# EAGLE design pmd_final (EAGLE 9.6.2)
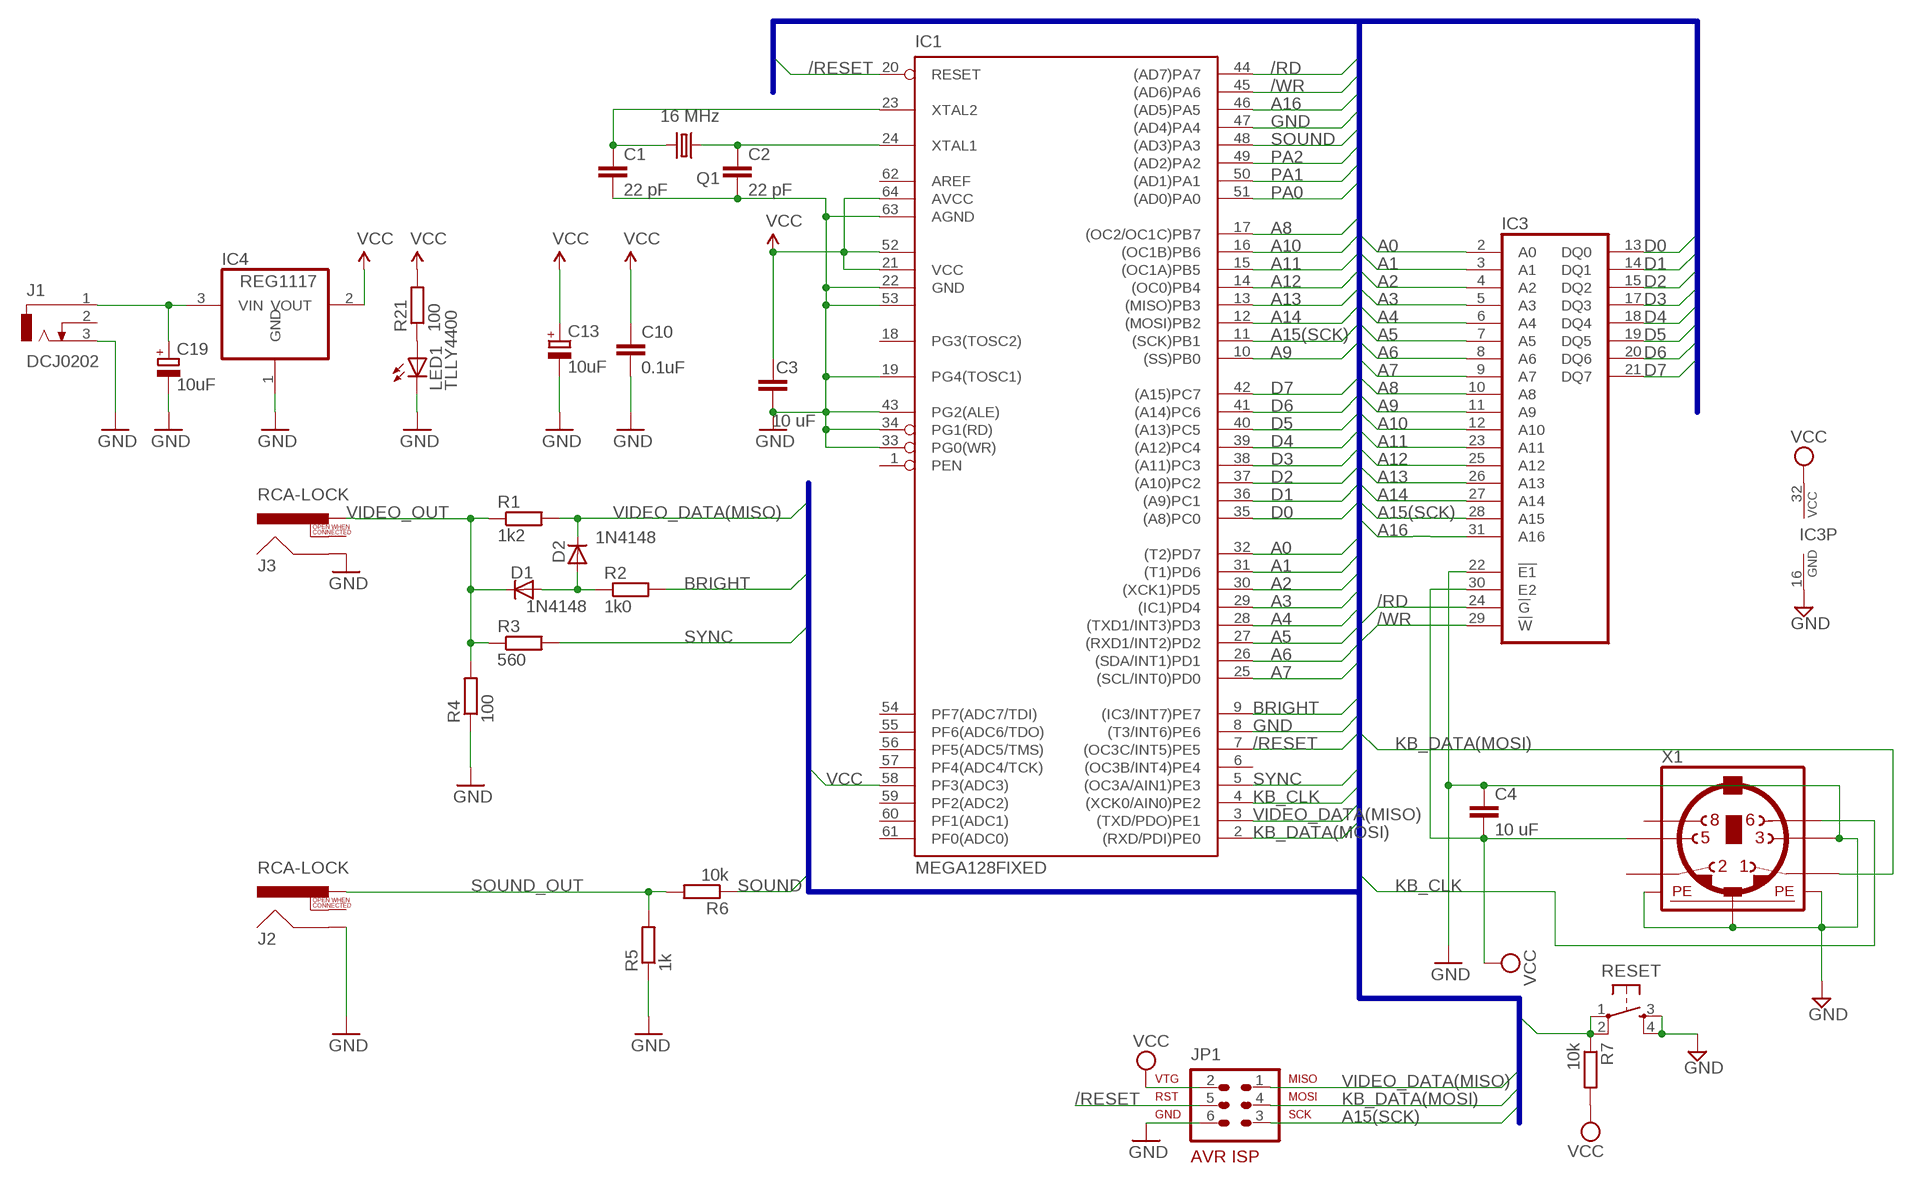
[diagram p0: schematic, sheet 1]

## Parts
C1  22 pF  C-EUC0805  [C0805]
C2  22 pF  C-EUC0805  [C0805]
C3  10 uF  C-EUC0805  [C0805]
C4  10 uF  C-EUC0805  [C0805]
C10  0.1uF  C-EUC0805  [C0805]
C13  10uF  CPOL-EUE2.5-5  [E2,5-5]
C19  10uF  CPOL-EUE2.5-5  [E2,5-5]
D1  1N4148  DIODE-MINIMELF  [MINIMELF]
D2  1N4148  DIODE-MINIMELF  [MINIMELF]
IC1  MEGA128FIXED  [TQFP64_14X14MM]
IC3  MCM6226AULTRAWIDE  [SOP32L]
IC4  REG1117  [SOT223]
J1  DCJ0202  [DCJ0202]
J2  RCA-LOCK  [RCA_LOCK]
J3  RCA-LOCK  [RCA_LOCK]
JP1  AVR-ISP-6R  [AVR-ISP-6R]
LED1  TLLY4400  [LED3MM]
Q1  16 MHz  CRYSTALHC49UP  [HC49UP]
R1  1k2  R-EU_R0805  [R0805]
R2  1k0  R-EU_R0805  [R0805]
R3  560  R-EU_R0805  [R0805]
R4  100  R-EU_R0805  [R0805]
R5  1k  R-EU_R0805  [R0805]
R6  10k  R-EU_R0805  [R0805]
R7  10k  R-EU_R0805  [R0805]
R21  100  R-EU_R0805  [R0805]
RESET  RESET  TAC_SWITCHPTH  [TACTILE-PTH]
X1  MINI_DIN_6  [M_DIN6]

## Nets
/RD: IC1.44((AD7)PA7) IC3.24(!G)
/RESET: IC1.7((OC3C/INT5)PE5) IC1.20(RESET) JP1.5 R7.1 RESET.1 RESET.2
/WR: IC1.45((AD6)PA6) IC3.29(!W)
A0: IC1.32((T2)PD7) IC3.2(A0)
A1: IC1.31((T1)PD6) IC3.3(A1)
A2: IC1.30((XCK1)PD5) IC3.4(A2)
A3: IC1.29((IC1)PD4) IC3.5(A3)
A4: IC1.28((TXD1/INT3)PD3) IC3.6(A4)
A5: IC1.27((RXD1/INT2)PD2) IC3.7(A5)
A6: IC1.26((SDA/INT1)PD1) IC3.8(A6)
A7: IC1.25((SCL/INT0)PD0) IC3.9(A7)
A8: IC1.17((OC2/OC1C)PB7) IC3.10(A8)
A9: IC1.10((SS)PB0) IC3.11(A9)
A10: IC1.16((OC1B)PB6) IC3.12(A10)
A11: IC1.15((OC1A)PB5) IC3.23(A11)
A12: IC1.14((OC0)PB4) IC3.25(A12)
A13: IC1.13((MISO)PB3) IC3.26(A13)
A14: IC1.12((MOSI)PB2) IC3.27(A14)
A15(SCK): IC1.11((SCK)PB1) IC3.28(A15) JP1.3
A16: IC1.46((AD5)PA5) IC3.31(A16)
BRIGHT: IC1.9((IC3/INT7)PE7) R2.2
D0: IC1.35((A8)PC0) IC3.13(DQ0)
D1: IC1.36((A9)PC1) IC3.14(DQ1)
D2: IC1.37((A10)PC2) IC3.15(DQ2)
D3: IC1.38((A11)PC3) IC3.17(DQ3)
D4: IC1.39((A12)PC4) IC3.18(DQ4)
D5: IC1.40((A13)PC5) IC3.19(DQ5)
D6: IC1.41((A14)PC6) IC3.20(DQ6)
D7: IC1.42((A15)PC7) IC3.21(DQ7)
GND: C1.2 C2.2 C3.1 C4.1 C10.2 C13.- C19.- IC1.8((T3/INT6)PE6) IC1.19(PG4(TOSC1)) IC1.22(GND) IC1.33(PG0(WR)) IC1.34(PG1(RD)) IC1.43(PG2(ALE)) IC1.47((AD4)PA4) IC1.53(GND1) IC1.63(AGND) IC3.16(GND) IC3.22(!E1) IC4.1(GND) J1.3 J2.SHELL J3.SHELL JP1.6 LED1.K(C) R4.1 R5.1 RESET.3 RESET.4 X1.3 X1.SH1(PE1) X1.SH2(PE2) X1.SH3(PE3)
KB_CLK: IC1.4((XCK0/AIN0)PE2) X1.6
KB_DATA(MOSI): IC1.2((RXD/PDI)PE0) JP1.4 X1.1
N$3: LED1.A R21.1
N$4: D1.A D2.A R2.1
PA0: IC1.51((AD0)PA0)
PA1: IC1.50((AD1)PA1)
PA2: IC1.49((AD2)PA2)
SOUND: IC1.48((AD3)PA3) R6.1
SOUND_OUT: J2.PIN R5.2 R6.2
SYNC: IC1.5((OC3A/AIN1)PE3) R3.2
VCC: C3.2 C4.2 C10.1 C13.+ IC1.21(VCC) IC1.52(VCC1) IC1.58(PF3(ADC3)) IC1.64(AVCC) IC3.30(E2) IC3.32(VCC) IC4.2(VOUT) JP1.2 R7.2 R21.2 X1.5
VIDEO_DATA(MISO): D2.C IC1.3((TXD/PDO)PE1) JP1.1 R1.2
VIDEO_OUT: D1.C J3.PIN R1.1 R3.1 R4.2
VIN [vcc]: C19.+ IC4.3(VIN) J1.1
XTAL1: C2.1 IC1.24(XTAL1) Q1.1
XTAL2: C1.1 IC1.23(XTAL2) Q1.2
Unconnected: IC1.1(PEN) IC1.6((OC3B/INT4)PE4) IC1.18(PG3(TOSC2)) IC1.54(PF7(ADC7/TDI)) IC1.55(PF6(ADC6/TDO)) IC1.56(PF5(ADC5/TMS)) IC1.57(PF4(ADC4/TCK)) IC1.59(PF2(ADC2)) IC1.60(PF1(ADC1)) IC1.61(PF0(ADC0)) IC1.62(AREF) J1.2 J2.SWITCH J3.SWITCH X1.2 X1.8

## Buses
GND,KB_CLK,KB_DATA(MOSI),VCC

## Library data of the parts
C1-C4 C10 = rcl:C-EU: CAPACITOR, European symbol
C13 C19 = rcl:CPOL-EU: POLARIZED CAPACITOR, European symbol
D1 D2 = diode:DIODE-: DIODE
IC1 = avr:MEGA128: MICROCONTROLLER 128 Kbytes FLASH 4 Kbytes SRAM 4 Kbytes EEPROM DUAL USART 8-channel 10 bit ADC
IC3 = my_memory:MCM6226A: MEMORY
IC4 = burr-brown:REG1117: 800mA and 1A Low Dropout (LDO) Positive Regulator 1.8V, 2.5V, 2.85V, 3.3V, 5V, and Adj; MPN: REG1117; OC_FARNELL: 1097566; OC_NEWARK: 14P6981
J1 = con-jack-igi:DCJ0202: DC POWER JACK Source: DCJ0202.pdf; OC_FARNELL: unknown; OC_NEWARK: unknown
J2 J3 = SparkFun-Connectors:RCA
JP1 = avr-6:AVR-ISP-6: AVR ISP-6 Serial Programming Header
LED1 = led-igi:TLLY4400: Low Current (2mA) LED 3 mm Tinted Diffused Package color YELLOW Source: Data sheet <http://www.farnell.com/datasheets/391098.pdf>; MF: VISHAY SEMICONDUCTOR; OC_FARNELL: 1612439
Q1 = crystal:CRYSTAL: CRYSTAL; OC_FARNELL: unknown; OC_NEWARK: unknown
R1-R7 R21 = resistor:R-EU_: RESISTOR, European symbol
RESET = SparkFun:TAC_SWITCH: Momentary Switch Button commonly used for reset or general input. Spark Fun Electronics SKU : COM-00097; PN: P8006S-ND
X1 = mini_din:MINI_DIN_6

## Net classes
1 vcc: width 0.254 mm

## Board
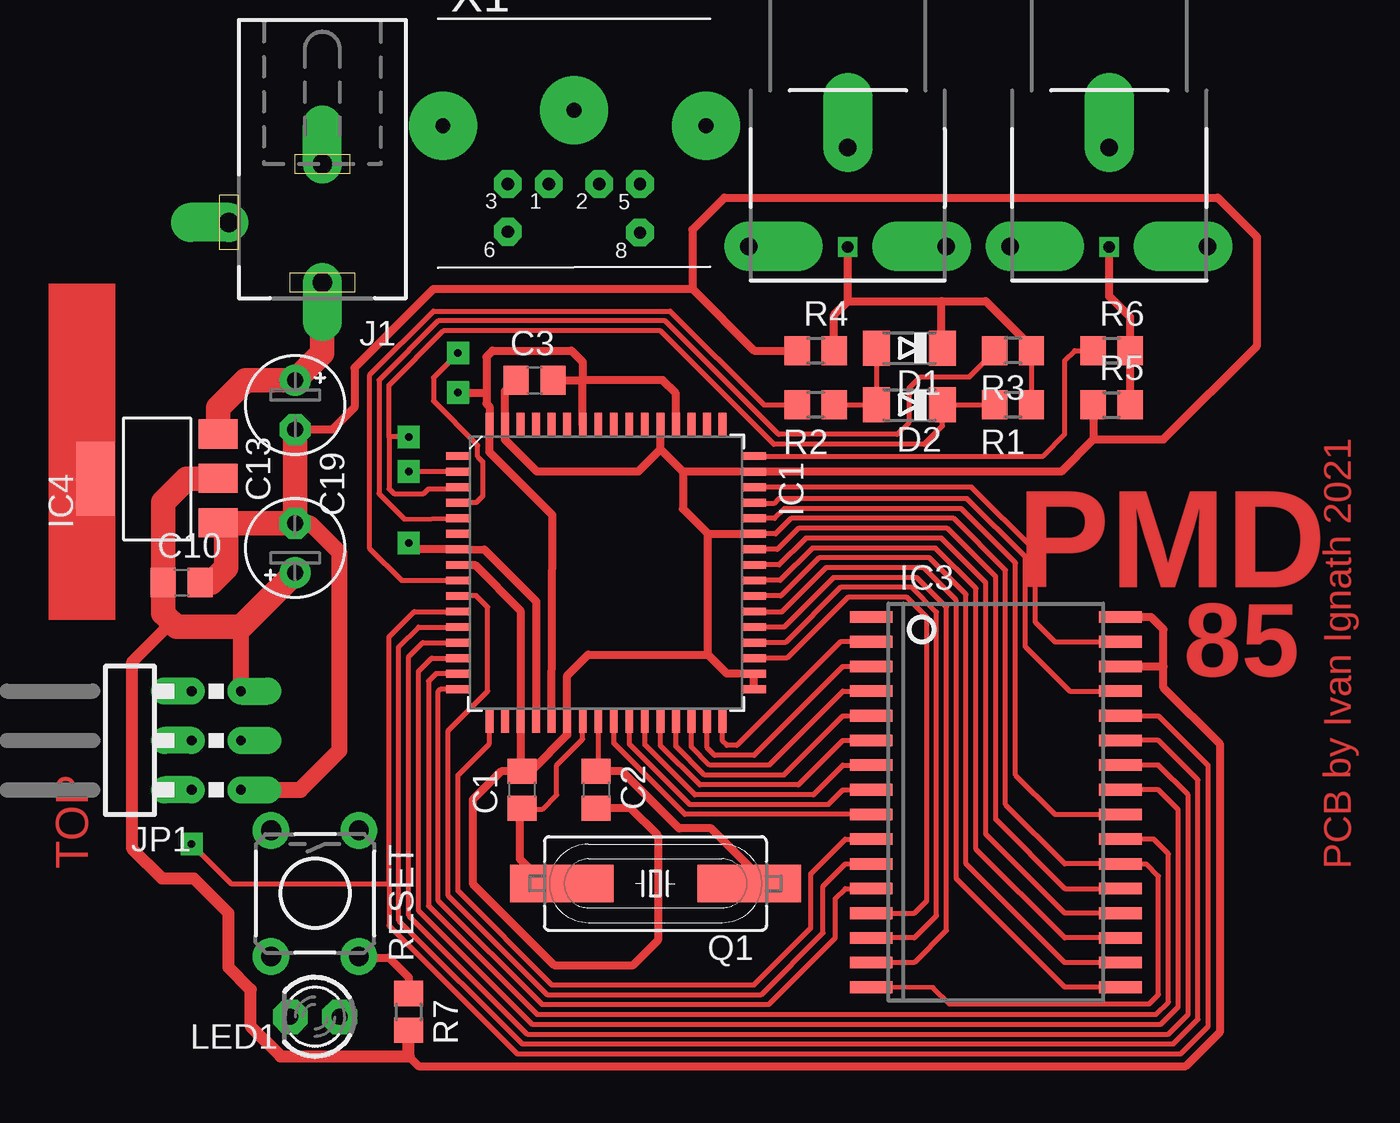
[diagram p1: board, top side]
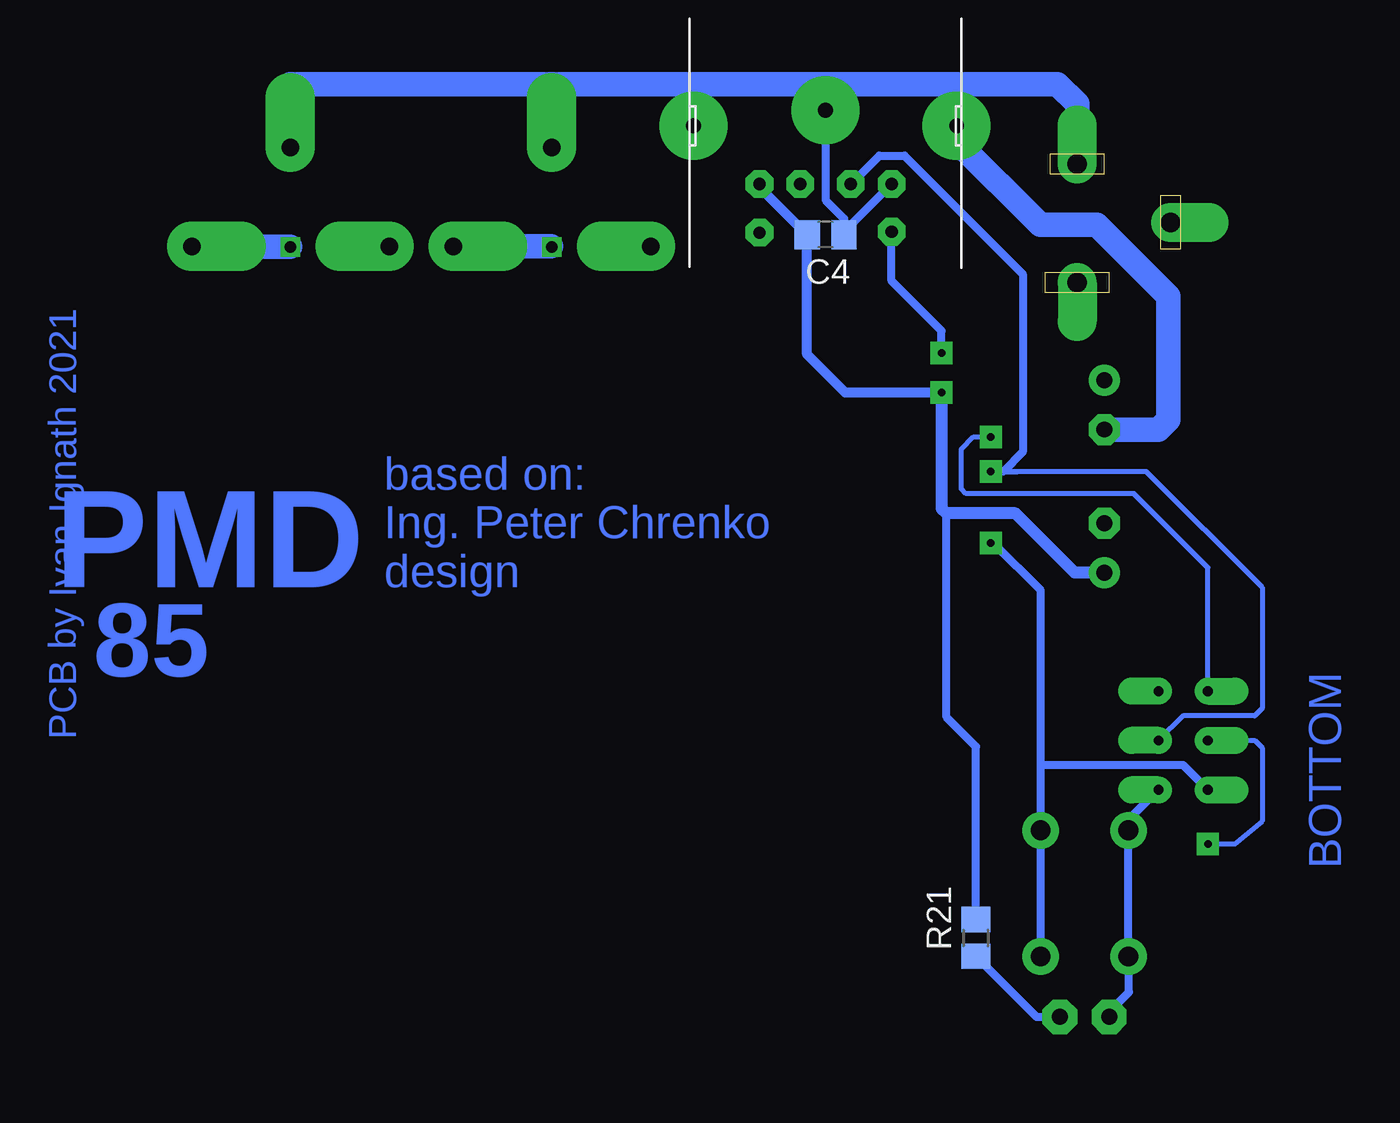
[diagram p2: board, bottom side, seen from below]

No outline drawn. Coordinates in mm, seen from the top.
Copper layers (1*16): Top 0.035mm / dielectric 1.5mm / Bottom 0.035mm
Design rules "default": minimum track width 10mil, minimum drill 24mil, track to track 10mil, track to pad 8mil, pad to pad 8mil, via to via 8mil, smd to smd 8mil, copper to edge 40mil, drill to drill 8mil, minimum pad ring 10mil, minimum via ring 8mil, stop-mask expansion 4mil, vias tented up to drill 0mil, thermal gap 10mil

### Footprints (pad centres in the part's own frame; a part is rotated, then mirrored left to right if it is on the bottom)
C0805 = smd 1.3 x 1.5: 1 -0.95,0; 2 0.95,0
E2,5-5 = drill 0.813 pad 1.6: + -1.27,0 | drill 0.813 pad 1.6 octagon: - 1.27,0
MINIMELF = smd 1.4 x 1.8: A 1.7,0; C -1.7,0
TQFP64_14X14MM = smd 0.4 x 1.27: 1 -6,-7.6; 2 -5.2,-7.6; 3 -4.4,-7.6; 4 -3.6,-7.6; 5 -2.8,-7.6; 6 -2,-7.6; 7 -1.2,-7.6; 8 -0.4,-7.6; 9 0.4,-7.6; 10 1.2,-7.6; 11 2,-7.6; 12 2.8,-7.6; 13 3.6,-7.6; 14 4.4,-7.6; 15 5.2,-7.6; 16 6,-7.6; 33 6,7.6; 34 5.2,7.6; 35 4.4,7.6; 36 3.6,7.6; 37 2.8,7.6; 38 2,7.6; 39 1.2,7.6; 40 0.4,7.6; 41 -0.4,7.6; 42 -1.2,7.6; 43 -2,7.6; 44 -2.8,7.6; 45 -3.6,7.6; 46 -4.4,7.6; 47 -5.2,7.6; 48 -6,7.6 | smd 1.27 x 0.4: 17 7.6,-6; 18 7.6,-5.2; 19 7.6,-4.4; 20 7.6,-3.6; 21 7.6,-2.8; 22 7.6,-2; 23 7.6,-1.2; 24 7.6,-0.4; 25 7.6,0.4; 26 7.6,1.2; 27 7.6,2; 28 7.6,2.8; 29 7.6,3.6; 30 7.6,4.4; 31 7.6,5.2; 32 7.6,6; 49 -7.6,6; 50 -7.6,5.2; 51 -7.6,4.4; 52 -7.6,3.6; 53 -7.6,2.8; 54 -7.6,2; 55 -7.6,1.2; 56 -7.6,0.4; 57 -7.6,-0.4; 58 -7.6,-1.2; 59 -7.6,-2; 60 -7.6,-2.8; 61 -7.6,-3.6; 62 -7.6,-4.4; 63 -7.6,-5.2; 64 -7.6,-6
SOP32L = smd 0.6 x 2.2: 1 -9.525,-6.416; 2 -8.255,-6.416; 3 -6.985,-6.416; 4 -5.715,-6.416; 5 -4.445,-6.416; 6 -3.175,-6.416; 7 -1.905,-6.416; 8 -0.635,-6.416; 9 0.635,-6.416; 10 1.905,-6.416; 11 3.175,-6.416; 12 4.445,-6.416; 13 5.715,-6.416; 14 6.985,-6.416; 15 8.255,-6.416; 16 9.525,-6.416; 17 9.525,6.416; 18 8.255,6.416; 19 6.985,6.416; 20 5.715,6.416; 21 4.445,6.416; 22 3.175,6.416; 23 1.905,6.416; 24 0.635,6.416; 25 -0.635,6.416; 26 -1.905,6.416; 27 -3.175,6.416; 28 -4.445,6.416; 29 -5.715,6.416; 30 -6.985,6.416; 31 -8.255,6.416; 32 -9.525,6.416
SOT223 = smd 1.499 x 2.007: 1 -2.261,-3.15; 2 0.025,-3.15; 3 2.311,-3.15 | smd 3.81 x 2.007: 4 0,3.15
DCJ0202 = drill 1 pad 2 offset: 1 0,3.1; 2 4.8,0; 3 0,-3
RCA_LOCK = drill 0.9 pad 2.54 offset: PIN 4.03,5.072; SHELL -1.067,0; SWITCH 4.03,-5.097
AVR-ISP-6R = drill 0.508 pad 1.397 offset: 1 -2.54,-1.27; 2 -2.54,1.27; 3 0,-1.27; 4 0,1.27; 5 2.54,-1.27; 6 2.54,1.27
LED3MM = drill 0.813 pad 1.778 octagon: A -1.27,0; K 1.27,0
HC49UP = smd 5.334 x 1.93: 1 -4.826,0; 2 4.826,0
R0805 = smd 1.3 x 1.5: 1 -0.95,0; 2 0.95,0
TACTILE-PTH = drill 1.016 pad 1.88: 1 -3.251,2.261; 2 3.251,2.261; 3 -3.251,-2.261; 4 3.251,-2.261
M_DIN6 = drill 0.635 pad 1.422 octagon: 1 -1.3,-3.75; 2 1.3,-3.75; 3 -3.4,-3.75; 5 3.4,-3.75; 6 -3.4,-6.2; 8 3.4,-6.25 | drill 0.762 pad 3.5: SH1 6.8,-0.75; SH2 0,0.05; SH3 -6.75,-0.75

### Placement (x,y rotation side)
C1  24.38,14.73 90 top
C2  28.19,14.73 270 top
C3  25.02,35.81 0 top
C4  27.05,43.31 180 bottom
C10  6.86,25.4 0 top
C13  12.7,27.18 90 top
C19  12.7,34.54 270 top
D1  44.32,37.47 180 top
D2  44.32,34.54 180 top
IC1  28.7,25.91 270 top
IC3  48.77,14.1 270 top
IC4  5.59,30.73 90 top
J1  14.1,43.94 180 top
J2  54.61,46.74 270 top
J3  41.15,46.74 270 top
JP1  8.64,17.27 270 top
LED1  13.72,3.05 180 top
Q1  31.24,9.91 180 top
R1  49.66,34.54 180 top
R2  39.5,34.54 180 top
R3  49.66,37.34 180 top
R4  39.5,37.34 0 top
R5  54.74,34.54 0 top
R6  54.74,37.34 0 top
R7  18.54,3.3 270 top
R21  19.3,7.11 90 bottom
RESET  13.72,9.4 270 top
X1  27.05,49.66 0 top

### Tracks (layer width: path | path; a pad name or v marks a point on that pad's centre or on a via)
/RD
  Top 0.254: IC3.24 51.82,13.46 49.78,15.49 49.78,26.42 46.99,29.21 37.89,29.21 37.39,28.71 IC1.44
/RESET  (via drill 0.38 pad 1.14)
  Top 0.406: RESET.2 16.03,6.1 17.53,6.1 18.54,5.08 R7.1 | IC1.20 25.1,24.43 22.44,27.09 IC1.7 18.87,27.11 v18.54,27.43
  Bottom 0.406: RESET.2 RESET.1 15.98,16 | v18.54,27.43 18.41,27.43 15.98,24.99 15.98,16 | JP1.5 8.64,16 15.98,16
/WR
  Top 0.254: IC3.29 52.58,19.81 50.29,22.1 50.29,26.72 47.3,29.72 37.59,29.72 37.34,29.46 36.35,29.46 IC1.45
A0
  Top 0.254: IC3.2 40.77,22.35 35.43,17.02 34.92,17.02 34.7,17.24 IC1.32
A1
  Top 0.254: IC3.3 40.89,21.08 36.32,16.51 34.29,16.51 33.9,16.9 IC1.31
A2
  Top 0.254: IC3.4 40.89,19.81 37.08,16 34.04,16 33.1,16.94 IC1.30
A3
  Top 0.254: IC3.5 40.89,18.54 37.85,15.49 33.78,15.49 32.3,16.97 IC1.29
A4
  Top 0.254: IC3.6 40.89,17.27 38.61,14.99 33.53,14.99 31.5,17.01 IC1.28
A5
  Top 0.254: IC3.7 40.89,16 39.37,14.48 33.27,14.48 30.7,17.05 IC1.27
A6
  Top 0.254: IC3.8 40.89,14.73 40.13,13.97 33.02,13.97 29.9,17.09 IC1.26
A7
  Top 0.254: IC3.9 32.77,13.46 29.1,17.13 IC1.25
A8
  Top 0.254: IC3.10 41.02,12.19 39.24,10.41 39.24,7.62 36.32,4.7 25.91,4.7 21.08,9.53 21.08,15.49 22.7,17.11 IC1.17
A9
  Top 0.254: IC1.10 22.01,24.72 22.61,24.13 22.61,19.81 20.57,17.78 20.57,9.27 25.65,4.19 36.7,4.19 39.88,7.37 39.88,9.78 41.02,10.92 IC3.11
A10
  Top 0.254: IC1.16 20.16,19.91 20.07,19.81 20.07,9.02 25.4,3.68 37.08,3.68 40.51,7.11 40.51,9.14 41.02,9.65 IC3.12
A11
  Top 0.254: IC1.15 19.95,20.71 19.56,20.32 19.56,8.76 25.15,3.17 57.02,3.17 57.66,3.81 57.66,11.43 56.9,12.19 IC3.23
A12
  Top 0.254: IC3.25 57.15,14.73 58.17,13.72 58.17,3.56 57.28,2.67 24.89,2.67 19.05,8.51 19.05,20.83 19.73,21.51 IC1.14
A13
  Top 0.254: IC3.26 57.15,16 58.67,14.48 58.67,3.17 57.66,2.16 24.64,2.16 18.54,8.26 18.54,21.59 19.26,22.31 IC1.13
A14
  Top 0.254: IC3.27 57.15,17.27 59.18,15.24 59.18,2.92 57.91,1.65 24.38,1.65 18.03,8 18.03,22.1 19.04,23.11 IC1.12
A15(SCK)  (via drill 0.38 pad 1.14)
  Top 0.254: IC3.28 57.15,18.54 59.69,16 59.69,2.54 58.29,1.14 24.13,1.14 17.53,7.75 17.53,9.91 | 17.53,9.91 17.53,22.61 18.83,23.91 IC1.11 | v7.37,11.94 9.4,9.91 17.53,9.91
  Bottom 0.254: JP1.3 4.95,17.27 4.57,16.89 4.57,13.12 5.99,11.94 v7.37,11.94
A16
  Top 0.254: IC3.31 51.82,22.35 50.8,23.37 50.8,27.03 47.52,30.31 IC1.46
BRIGHT
  Top 0.254: IC1.9 18.17,25.52 16.51,27.18 16.51,36.07 19.81,39.37 32,39.37 36.83,34.54 R2.2
D0
  Top 0.254: IC1.35 38.02,21.51 41.15,24.64 44.2,24.64 45.21,23.62 45.21,9.02 44.58,8.38 IC3.13
D1
  Top 0.254: IC3.14 44.58,7.11 45.72,8.26 45.72,23.88 44.45,25.15 40.77,25.15 37.93,22.31 IC1.36
D2
  Top 0.254: IC3.15 44.58,5.84 46.23,7.49 46.23,24.13 44.7,25.65 40.41,25.65 37.87,23.11 IC1.37
D3
  Top 0.254: IC3.17 52.32,4.57 46.74,10.16 46.74,24.49 45.06,26.16 40.03,26.16 37.74,23.88 36.33,23.88 IC1.38
D4
  Top 0.254: IC3.18 52.32,5.84 47.24,10.92 47.24,24.79 45.36,26.67 39.67,26.67 37.71,24.71 IC1.39
D5
  Top 0.254: IC3.19 52.32,7.11 47.75,11.68 47.75,25.09 45.67,27.18 39.33,27.18 37.66,25.51 IC1.40
D6
  Top 0.254: IC3.20 52.32,8.38 48.26,12.45 48.26,25.4 45.97,27.69 38.99,27.69 37.62,26.31 IC1.41
D7
  Top 0.254: IC3.21 52.32,9.65 48.77,13.21 48.77,25.7 46.28,28.19 38.61,28.19 37.52,27.11 IC1.42
GND
  Top 0.254: IC3.16 45.54,4.55 46.38,3.71 56.67,3.71 57.15,4.19 57.15,10.29 56.52,10.92 IC3.22 52.32,10.92 49.28,13.97 49.28,26.04 46.61,28.7 38.23,28.7 37.43,27.91 IC1.43 | 24.12,15.95 C1.2
  Top 0.406: IC1.8 21.96,26.3 24.3,23.96 IC1.19 24.3,15.76 C1.2 | IC1.33 IC1.34 34.92,20.71 33.94,21.68 | C1.2 24.45,15.75 24.89,15.75 26.7,17.56 IC1.22 26.7,20.61 27.78,21.68 33.94,21.68 | C1.2 23.3,15.68 21.84,14.22 21.84,9.91 26.04,5.71 30.1,5.71 31.37,6.99 31.37,12.38 29.97,13.78 C2.2 | 53.79,32.77 57.4,32.77 62.23,37.59 62.23,43.18 60.2,45.21 34.8,45.21 33.15,43.56 33.15,40.51 | C19.- 14.61,33.27 15.75,34.42 15.75,36.45 19.81,40.51 33.15,40.51 | R5.1 53.79,32.77 | R4.1 36.32,37.34 33.15,40.51 | 53.79,32.77 52.14,31.11 IC1.47 32.66,31.11 | C3.1 23.5,35.25 IC1.63 23.5,32.76 25.15,31.11 30.35,31.11 31.5,32.26 | 31.5,32.26 IC1.53 | 32.66,31.11 31.5,32.26 | 32.66,31.11 32.66,29.19 33.94,27.91 | 33.94,27.91 IC1.43 | 33.94,21.68 33.94,27.91
  Top 0.813: JP1.6 12.95,14.73 14.99,16.76 14.99,26.92 13.46,28.45 C13.-
  Top 1.27: C19.- C13.- 8.76,28.45 IC4.1 9.14,28.07 9.14,26.16 8.38,25.4 C10.2
  Bottom 0.406: JP1.6 11.46,13.18 RESET.3 RESET.4 11.43,6.12 11.43,4.32 12.45,3.3 LED1.K | X1.3 26.1,43.46 C4.1 26.1,44.13 27.05,45.09 X1.SH2
  Bottom 0.508: C4.1 26,43.31
  Bottom 1.27: C19.- 9.91,33.27 9.4,33.78 9.4,40.13 13.08,43.81 16,43.81 20.3,48.11 X1.SH3 20.3,50.95 20.19,51.05 | J2.SHELL 54.61,51.05 41.4,51.05 | 41.4,51.05 33.78,51.05 | J3.SHELL 41.15,50.8 41.4,51.05 | J1.3 14.1,50.04 15.11,51.05 20.19,51.05 | X1.SH1 33.85,50.98 33.78,51.05 | 33.78,51.05 26.92,51.05 | 26.92,51.05 20.19,51.05 | X1.SH2 26.92,49.83 26.92,51.05
KB_CLK  (via drill 0.38 pad 1.14)
  Top 0.254: v21.08,37.21 19.81,35.94 19.81,34.75 22.1,32.46 22.1,31.88 22.35,31.62 22.35,29.84 22.02,29.51 IC1.4
  Bottom 0.406: v21.08,37.21 21.08,38.35 23.65,40.92 X1.6
KB_DATA(MOSI)  (via drill 0.38 pad 1.14)
  Top 0.254: IC1.2 20.85,31.11 v18.54,31.11
  Bottom 0.254: 17.14,31.11 v18.54,31.11 10.54,31.11 4.57,25.15 4.57,18.92 4.95,18.54 8.64,18.54 JP1.4
  Bottom 0.406: X1.1 24.29,47.37 22.99,47.37 16.89,41.27 16.89,32.13 17.91,31.11 v18.54,31.11
N$3
  Bottom 0.406: R21.1 16.19,3.05 LED1.A
N$4
  Top 0.254: R2.1 D2.A D1.A
SOUND
  Top 0.254: R6.1 52.83,37.34 52.32,36.83 52.32,33.02 51.21,31.91 IC1.48
SOUND_OUT  (via drill 0.6)
  Top 0.406: R5.2 R6.2 55.69,39.05 54.61,40.13 v54.61,42.67
  Bottom 1.27: v54.61,42.67 59.65,42.67 J2.PIN
SYNC
  Top 0.254: IC1.5 18.33,28.66 17.02,29.97 17.02,35.81 20.07,38.86 31.75,38.86 37.59,33.02 43.69,33.02 44.32,33.66 44.32,35.43 44.88,35.99 47.42,35.99 48.71,37.28 R3.2
VCC  (via drill 0.38 pad 1.14)
  Top 0.406: IC1.21 25.95,28.66 25.95,28.87 22.7,32.12 IC1.64 22.7,34.45 22.54,34.61 22.54,35.18 | 22.54,35.18 22.54,37.02 22.86,37.34 26.92,37.34 27.5,36.76 27.5,35.76 | v21.08,35.18 22.54,35.18 | 18.54,1.02 19.05,0.51 58.55,0.51 60.33,2.29 60.33,17.07 57.4,19.99 57.4,21.08 | 57.4,21.08 57.4,22.99 56.77,23.62 IC3.32 | IC3.30 57.4,21.08 | IC1.52 32.3,35.13 31.62,35.81 27.56,35.81 27.5,35.76 | IC1.58 27.5,35.76 | C3.2 27.45,35.81 27.5,35.76
  Top 0.61: IC4.2 8.71,30.73 | 6.35,23.37 4.32,21.34 4.32,11.68 5.84,10.16 7.49,10.16 9.27,8.38 9.27,5.59 10.41,4.45 10.41,2.54 11.94,1.02 18.54,1.02 R7.2
  Top 0.813: JP1.2 9.91,23.11
  Top 1.27: 8.71,30.73 7.11,30.73 5.91,29.53 C10.1 5.91,23.81 6.35,23.37 6.6,23.11 9.91,23.11 C13.+
  Bottom 0.406: 20.83,28.96 20.83,18.48 19.3,16.95 R21.2
  Bottom 0.508: v21.08,35.18 26.04,35.18 28,37.15 C4.2 30.45,45.76 X1.5
  Bottom 0.61: C13.+ 14.22,25.91 17.27,28.96 20.83,28.96 21.08,29.21 v21.08,35.18
VIDEO_DATA(MISO)  (via drill 0.38 pad 1.14)
  Top 0.254: IC1.3 20.93,30.23 19.56,30.23 19.3,29.97 17.78,29.97 17.53,30.23 17.53,32.89 | v18.54,32.89 17.53,32.89 | 17.53,32.89 17.53,35.56 20.32,38.35 31.5,38.35 37.34,32.51 45.07,32.51 46.02,33.47 D2.C R1.2
  Bottom 0.254: JP1.1 7.37,26.16 11.18,29.97 19.81,29.97 20.07,30.23 20.07,32.26 19.43,32.89 v18.54,32.89
VIDEO_OUT  (via drill 0.6)
  Top 0.254: R3.1 R1.1
  Top 0.406: R4.2 40.45,39.18 41.15,39.88 | 41.15,39.88 v41.15,42.67 | 41.15,39.88 45.97,39.88 | 45.97,39.88 48.26,39.88 50.61,37.53 R3.1 | D1.C 45.97,37.51 45.97,39.88
  Bottom 0.406: 41.18,42.71 v41.15,42.67
  Bottom 1.27: J3.PIN 41.18,42.71
VIN
  Top 1.27: J1.1 14.1,37.21 C19.+ 10.16,35.81 8.74,34.39 IC4.3
XTAL1
  Top 0.254: IC1.24 28.3,15.79 C2.1
  Top 0.406: Q1.1 36.07,10.79 34.11,12.75 32.46,12.75 29.53,15.68 C2.1
XTAL2
  Top 0.254: C1.1 24.45,13.72 25.4,13.72 26.16,14.48 26.16,16 27.5,17.34 IC1.23
  Top 0.406: C1.1 24.26,13.65 24.26,11.18 25.53,9.91 Q1.2
(copper drawn outside any net)
  shapes: Top area x1

### Text on the board
Top: PMD | 85 | TOP | PCB by Ivan Ignath 2021
Bottom: PCB by Ivan Ignath 2021 | PMD | based on: / Ing. Peter Chrenko / design | 85 | BOTTOM